# Altium schematic sheet PSRAM.SchDoc: PSRAM
size A4; Author: P.A.; CompanyName: STMicroelectronics; Organization: Microcontrollers Division; Address1: 12, Rue Jules HOROWITZ; Address2: 38019 Grenoble; Address3: FRANCE; DocumentNumber: MB1261; Revision: B.01; SheetNumber: 12; SheetTotal: 15; Project: STM32L496G-DISCO
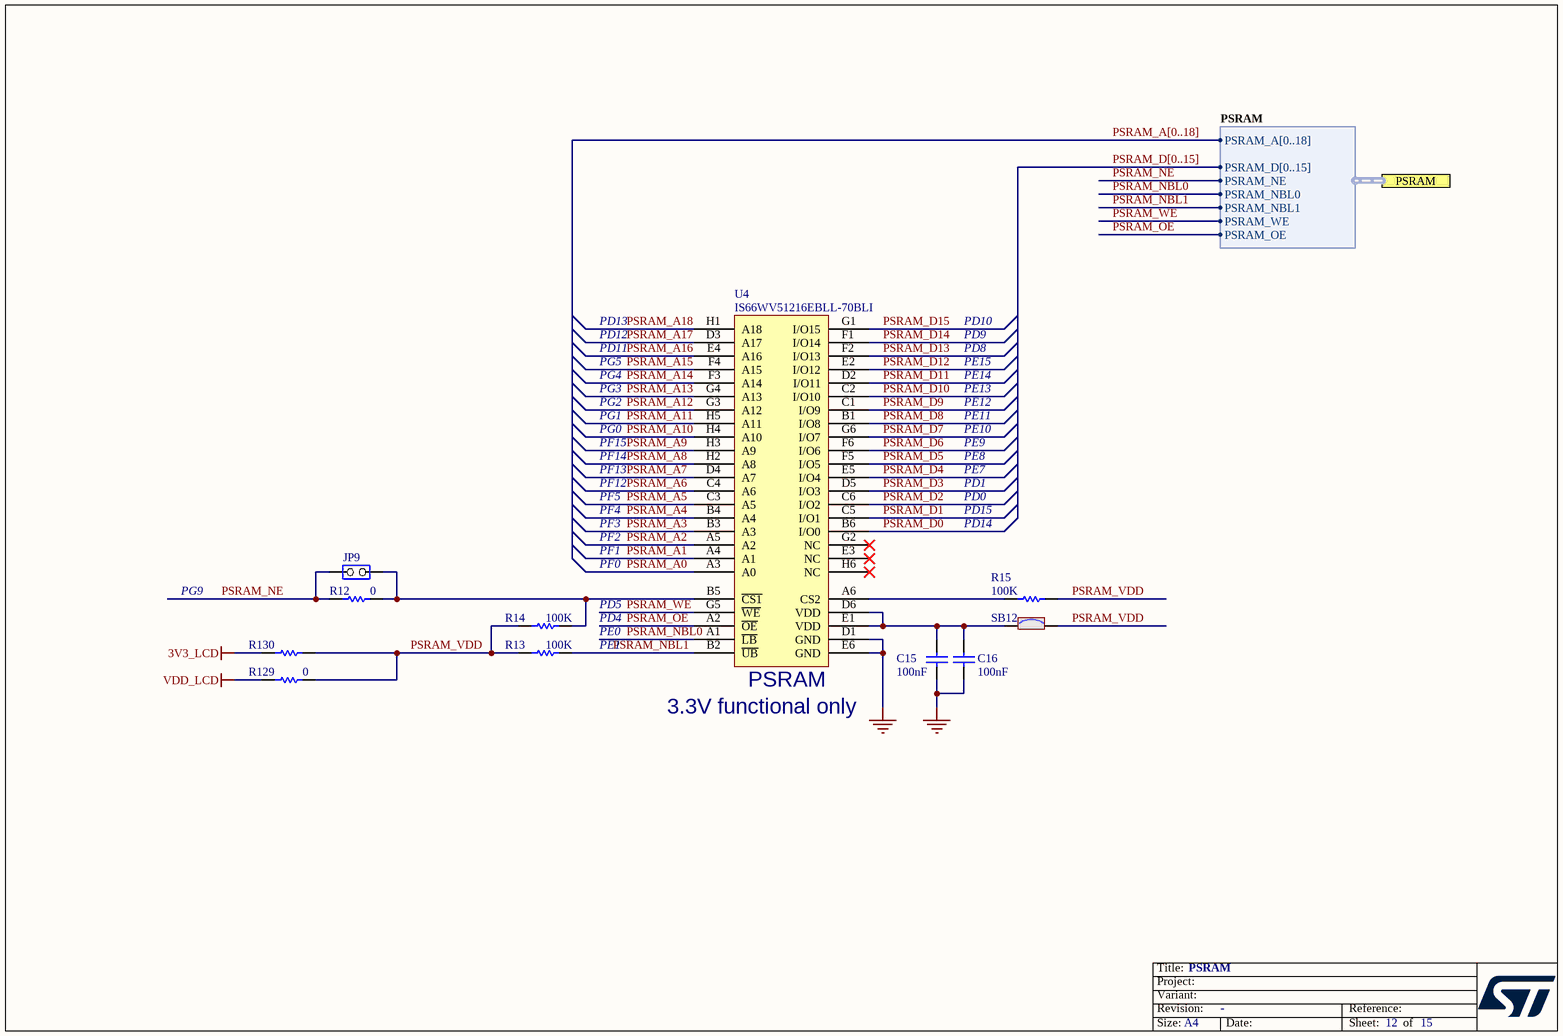
[diagram p0: PSRAM.SchDoc]

## Parts
C15  value 100nF  [0603C]  (hidden comment: CC0603KRX7R7BB104)
C16  value 100nF  [0603C]  (hidden comment: CC0603KRX7R7BB104)
JP9  2 PIN Jumper  [SIP2]  (value not drawn)
R12  0  [0603R]
R13  value 100K  [0603R]  (hidden comment: RC0603FR-07100KL)
R14  value 100K  [0603R]  (hidden comment: RC0603FR-07100KL)
R15  value 100K  [0603R]  (hidden comment: RC0603FR-07100KL)
R129  value 0  [0603R]  (hidden comment: RC0603JR-070RL)
R130  (no value)  [0603R]
SB12  Solder Bridge ON  [SB_0603]  (value not drawn)
U4  IS66WV51216EBLL-70BLI  [FBGA48_0R75_6X8]

## Ports
PSRAM (harness PSRAM)

## Harnesses
PSRAM: PSRAM_A[0..18], PSRAM_NE, PSRAM_NBL0, PSRAM_WE, PSRAM_OE, PSRAM_D[0..15], PSRAM_NBL1

## Nets
3V3_LCD: R130.2
GND: C15.2 C16.2 U4.D1(GND) U4.E6(GND)
VDD_LCD: R129.2
PSRAM_A0: U4.A3(A0)
PSRAM_A1: U4.A4(A1)
PSRAM_A2: U4.A5(A2)
PSRAM_A3: U4.B3(A3)
PSRAM_A4: U4.B4(A4)
PSRAM_A5: U4.C3(A5)
PSRAM_A6: U4.C4(A6)
PSRAM_A7: U4.D4(A7)
PSRAM_A8: U4.H2(A8)
PSRAM_A9: U4.H3(A9)
PSRAM_A10: U4.H4(A10)
PSRAM_A11: U4.H5(A11)
PSRAM_A12: U4.G3(A12)
PSRAM_A13: U4.G4(A13)
PSRAM_A14: U4.F3(A14)
PSRAM_A15: U4.F4(A15)
PSRAM_A16: U4.E4(A16)
PSRAM_A17: U4.D3(A17)
PSRAM_A18: U4.H1(A18)
PSRAM_D0: U4.B6(I/O0)
PSRAM_D1: U4.C5(I/O1)
PSRAM_D2: U4.C6(I/O2)
PSRAM_D3: U4.D5(I/O3)
PSRAM_D4: U4.E5(I/O4)
PSRAM_D5: U4.F5(I/O5)
PSRAM_D6: U4.F6(I/O6)
PSRAM_D7: U4.G6(I/O7)
PSRAM_D8: U4.B1(I/O8)
PSRAM_D9: U4.C1(I/O9)
PSRAM_D10: U4.C2(I/O10)
PSRAM_D11: U4.D2(I/O11)
PSRAM_D12: U4.E2(I/O12)
PSRAM_D13: U4.F2(I/O13)
PSRAM_D14: U4.F1(I/O14)
PSRAM_D15: U4.G1(I/O15)
PSRAM_NBL0: U4.A1(~{LB}) ; port PSRAM.PSRAM_NBL0
PSRAM_NBL1: R13.1 U4.B2(~{UB}) ; port PSRAM.PSRAM_NBL1
PSRAM_NE: JP9.1(COMMON) R12.2 ; port PSRAM.PSRAM_NE
PSRAM_OE: U4.A2(~{OE}) ; port PSRAM.PSRAM_OE
PSRAM_VDD: R13.2 R14.2 R15.1 R129.1 R130.1 SB12.2
PSRAM_WE: U4.G5(~{WE}) ; port PSRAM.PSRAM_WE
NetC15_1: C15.1 C16.1 SB12.1 U4.D6(VDD) U4.E1(VDD)
NetJP9_2: JP9.2(NO) R12.1 R14.1 U4.B5(~{CS1})
NetR15_2: R15.2 U4.A6(CS2)

Not connected (* = marked no-connect by the designer): U4 E3(NC)* G2(NC)* H6(NC)*

## Buses and harness runs
bus PSRAM_A[0..18]
bus PSRAM_D[0..15]

## Notes on the sheet
- PD11
- PD12
- PD13
- PG4
- PG5
- PE14
- PE15
- PD8
- PD9
- PD10
- PF15
- PG0
- PG1
- PG2
- PG3
- PE9
- PE10
- PE11
- PE12
- PE13
- PF4
- PF5
- PF12
- PF13
- PF14
- PD15
- PD0
- PD1
- PE7
- PE8
- PF0
- PF1
- PF2
- PF3
- PD14
- PG9
- PD5
- PD4
- PE0
- PE1
- 3.3V functional only
- (near U4) PSRAM
- Title:
- Project:
- Size:
- Revision:
- Variant:
- A4
- -
- Date:
- Reference:
- Sheet:
- of

## Library data of the parts
C15 C16 = Cap: Capacitor,100nF,10%,16V,X7R,0603,YAGEO; Ordered by: Subcon; Published: 8-Jun-2000; Revision: July-2002: Re-released for DXP Platform.; Publisher: Altium Limited; Manuf_1: YAGEO; Manuf_Part_1: CC0603KRX7R7BB104
JP9 = JP2: Manuf_1: lyconn; Manuf_Part_1: 313102S111116; Ordered by: Subcon; Assembly: with jumper; ECCN_US/EU: NA
R12 = res1: Resistor, 0 ,0603,1%,YAGEO; Manuf_Part_1: RC0603JR-070RL; Ordered by: Subcon; ECCN_US/EU: NA; Published: 8-Jun-2000; Revision: July-2002: Re-released for DXP Platform.; Publisher: Altium Limited; Value: 0; Manuf_1: YAGEO
R13-R15 = res1: Resistor,100K,0603,1%,YAGEO; Ordered by: Subcon; ECCN_US/EU: NA; Published: 8-Jun-2000; Revision: July-2002: Re-released for DXP Platform.; Publisher: Altium Limited; Manuf_1: YAGEO; Manuf_Part_1: RC0603FR-07100KL
R129 = res1: Resistor, 0 ,0603,1%,YAGEO; Ordered by: Subcon; ECCN_US/EU: NA; Published: 8-Jun-2000; Revision: July-2002: Re-released for DXP Platform.; Publisher: Altium Limited; Manuf_1: YAGEO; Manuf_Part_1: RC0603JR-070RL
R130 = res1: Resistor, 0 ,0603,1%,YAGEO; Manuf_Part_1: RC0603JR-070RL; Value: 0; Ordered by: Subcon; ECCN_US/EU: NA; Published: 8-Jun-2000; Revision: July-2002: Re-released for DXP Platform.; Publisher: Altium Limited; Manuf_1: YAGEO
SB12 = SB_ON: Manuf_1: YAGEO; Manuf_Part_1: RC0603JR-070RL; Solder: YES; Ordered By: Subcon; Revision: July-2002: Re-released for DXP Platform.; ECCN_US/EU: N/A
U4 = IS66WV51216EBLL-70BLI: 8M Bit static RAMs organized as 512K words by  16 bits.; Manuf_1: ISSI; Ordered by: STM; Manuf_Part_1: IS66WV51216EBLL-70BLI